# EAGLE design isa (EAGLE 9.4.0)
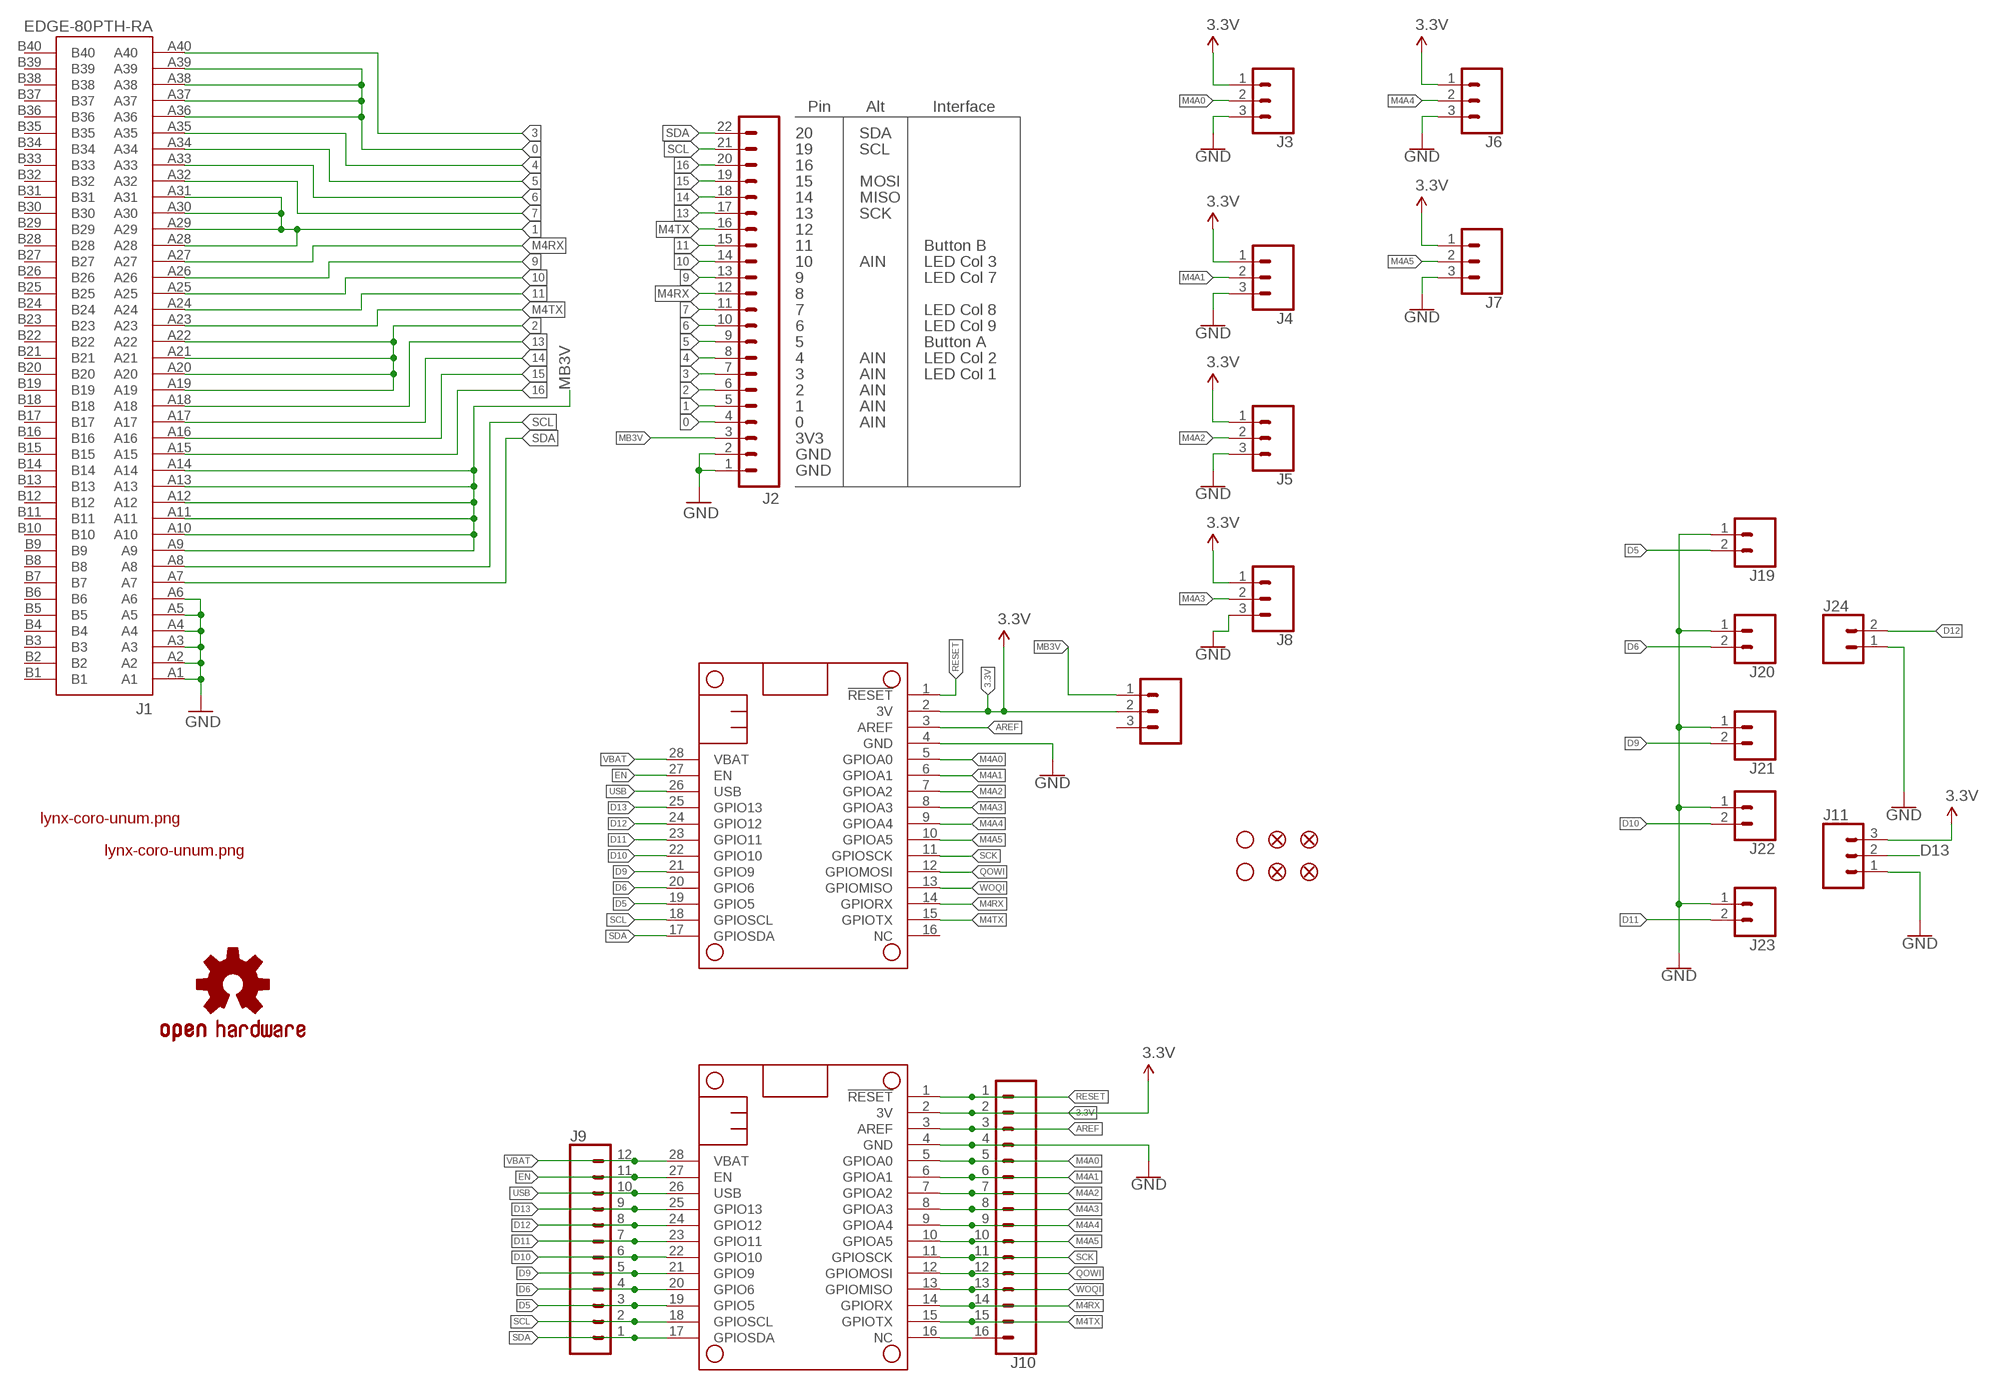
[diagram p0: schematic, sheet 1]

## Parts
FD1  FIDUCIAL1X2  [FIDUCIAL-1X2]
FD2  FIDUCIAL1X2  [FIDUCIAL-1X2]
FD3  FIDUCIAL1X2  [FIDUCIAL-1X2]
FD4  FIDUCIAL1X2  [FIDUCIAL-1X2]
H1  STAND-OFF  [STAND-OFF]
H2  STAND-OFF  [STAND-OFF]
J1  EDGE-80PTH-RA  [VEC-127-080-R]
J2  M22PTH  [1X22]
J3  CONN_03SCREW  [SCREWTERMINAL-3.5MM-3]
J4  CONN_03SCREW  [SCREWTERMINAL-3.5MM-3]
J5  CONN_03SCREW  [SCREWTERMINAL-3.5MM-3]
J6  CONN_03SCREW  [SCREWTERMINAL-3.5MM-3]
J7  CONN_03SCREW  [SCREWTERMINAL-3.5MM-3]
J8  CONN_03SCREW  [SCREWTERMINAL-3.5MM-3]
J9  CONN_12LOCK  [1X12_LOCK]
J10  CONN_16LOCK  [1X16_LOCK]
J11  CONN_03SCREW  [SCREWTERMINAL-3.5MM-3]
J12  CONN_03  [1X03]
J19  CONN_023.5MM  [SCREWTERMINAL-3.5MM-2]
J20  CONN_023.5MM  [SCREWTERMINAL-3.5MM-2]
J21  CONN_023.5MM  [SCREWTERMINAL-3.5MM-2]
J22  CONN_023.5MM  [SCREWTERMINAL-3.5MM-2]
J23  CONN_023.5MM  [SCREWTERMINAL-3.5MM-2]
J24  CONN_023.5MM  [SCREWTERMINAL-3.5MM-2]
LOGO3  OSHW-LOGOS  [OSHW-LOGO-S]
MS1  FEATHERWING_NODIM  [FEATHERWING_DIM]
MS2  FEATHERWING_NODIM  [FEATHERWING_DIM]
U$3  LYNX#CORO#UNUM#PNG  [LYNX#CORO#UNUM#PNG]
U$4  LYNX#CORO#UNUM#PNG  [LYNX#CORO#UNUM#PNG]

## Nets
0: J1.A36 J1.A37 J1.A38 J1.A39 J2.4
1: J1.A28 J1.A29 J1.A30 J1.A31 J2.5
2: J1.A19 J1.A20 J1.A21 J1.A22 J2.6
3: J1.A40 J2.7
3.3V: J3.1 J4.1 J5.1 J6.1 J7.1 J8.1 J10.2 J11.3 J12.2 MS1.2(3V) MS2.2(3V)
4: J1.A35 J2.8
5: J1.A34 J2.9
6: J1.A33 J2.10
7: J1.A32 J2.11
9: J1.A26 J2.13
10: J1.A25 J2.14
11: J1.A24 J2.15
13: J1.A18 J2.17
14: J1.A17 J2.18
15: J1.A16 J2.19
16: J1.A15 J2.20
AREF: J10.3 MS1.3(AREF) MS2.3(AREF)
D5: J9.3 J19.2 MS1.19(GPIO5) MS2.19(GPIO5)
D6: J9.4 J20.2 MS1.20(GPIO6) MS2.20(GPIO6)
D9: J9.5 J21.2 MS1.21(GPIO9) MS2.21(GPIO9)
D10: J9.6 J22.2 MS1.22(GPIO10) MS2.22(GPIO10)
D11: J9.7 J23.2 MS1.23(GPIO11) MS2.23(GPIO11)
D12: J9.8 J24.2 MS1.24(GPIO12) MS2.24(GPIO12)
D13: J9.9 J11.2 MS1.25(GPIO13) MS2.25(GPIO13)
EN: J9.11 MS1.27(EN) MS2.27(EN)
GND: J1.A1 J1.A2 J1.A3 J1.A4 J1.A5 J1.A6 J2.1 J2.2 J3.3 J4.3 J5.3 J6.3 J7.3 J8.3 J10.4 J11.1 J19.1 J20.1 J21.1 J22.1 J23.1 J24.1 MS1.4(GND) MS2.4(GND)
M4A0: J3.2 J10.5 MS1.5(GPIOA0) MS2.5(GPIOA0)
M4A1: J4.2 J10.6 MS1.6(GPIOA1) MS2.6(GPIOA1)
M4A2: J5.2 J10.7 MS1.7(GPIOA2) MS2.7(GPIOA2)
M4A3: J8.2 J10.8 MS1.8(GPIOA3) MS2.8(GPIOA3)
M4A4: J6.2 J10.9 MS1.9(GPIOA4) MS2.9(GPIOA4)
M4A5: J7.2 J10.10 MS1.10(GPIOA5) MS2.10(GPIOA5)
M4RX: J1.A27 J2.12 J10.14 MS1.14(GPIORX) MS2.14(GPIORX)
M4TX: J1.A23 J2.16 J10.15 MS1.15(GPIOTX) MS2.15(GPIOTX)
MB3V: J1.A9 J1.A10 J1.A11 J1.A12 J1.A13 J1.A14 J2.3 J12.1
N$15: J10.16 MS2.16(NC)
QOWI: J10.12 MS1.12(GPIOMOSI) MS2.12(GPIOMOSI)
RESET: J10.1 MS1.1(!RESET) MS2.1(!RESET)
SCK: J10.11 MS1.11(GPIOSCK) MS2.11(GPIOSCK)
SCL: J1.A8 J2.21 J9.2 MS1.18(GPIOSCL) MS2.18(GPIOSCL)
SDA: J1.A7 J2.22 J9.1 MS1.17(GPIOSDA) MS2.17(GPIOSDA)
USB: J9.10 MS1.26(USB) MS2.26(USB)
VBAT: J9.12 MS1.28(VBAT) MS2.28(VBAT)
WOQI: J10.13 MS1.13(GPIOMISO) MS2.13(GPIOMISO)
Unconnected: J1.B1 J1.B2 J1.B3 J1.B4 J1.B5 J1.B6 J1.B7 J1.B8 J1.B9 J1.B10 J1.B11 J1.B12 J1.B13 J1.B14 J1.B15 J1.B16 J1.B17 J1.B18 J1.B19 J1.B20 J1.B21 J1.B22 J1.B23 J1.B24 J1.B25 J1.B26 J1.B27 J1.B28 J1.B29 J1.B30 J1.B31 J1.B32 J1.B33 J1.B34 J1.B35 J1.B36 J1.B37 J1.B38 J1.B39 J1.B40 J12.3 MS1.16(NC)

## Notes on the sheet
- Pin | Alt | Interface
- 20 | SDA
- 19 | SCL
- 16
- 15 | MOSI
- 14 | MISO
- 13 | SCK
- 12
- 11 | Button B
- 10 | AIN | LED Col 3
- 9 | LED Col 7
- 8
- 7 | LED Col 8
- 6 | LED Col 9
- 5 | Button A
- 4 | AIN | LED Col 2
- 3 | AIN | LED Col 1
- 2 | AIN
- 1 | AIN
- 0 | AIN
- 3V3
- GND
- GND

## Library data of the parts
FD1-FD4 = SparkFun-Aesthetics:FIDUCIAL: Fiducial Alignment Points Various fiducial points for machine vision alignment.
H1 H2 = SparkFun-Electromechanical:STAND-OFF: #4 Stand Off This is the mechanical footprint for a #4 phillips button head screw. Use the keepout ring to avoid running the screw head into surrounding components. SKU : PRT-00447
J1 = local_lib:EDGE-80: Card edge connector (80 pin) for accepting a PCB with finger edge pins. This connector will accept the BBC micro:bit board.; PROD_ID: CONN-13452
J2 = local_lib:M22: Standard 22-pin 0.1" header; PROD_ID: CONN-13453
J3-J8 J11 = SparkFun-Connectors:CONN_03: Multi connection point. Often used as Generic Header-pin footprint for 0.1 inch spaced/style header connections On any of the 0.1 inch spaced packages, you can populate with these: Break Away Headers - Straight <https://www.sparkfun.com/products/116> (PRT-00116) Break Away Male Headers - Right Angle <https://www.sparkfun.com/products/553> (PRT-00553) Female Headers <https://www.sparkfun.com/products/115> (PRT-00115) Break Away Headers - Machine Pin <https://www.sparkfun.com/products/117> (PRT-00117) Break Away Female Headers - Swiss Machine Pin <https://www.sparkfun.com/products/743> (PRT-00743) Stackable Header - 3 Pin (Female, 0.1") <https://www.sparkfun.com/products/13875> (PRT-13875) For SCREWTERMINALS and SPRING TERMINALS visit here: Screw Terimnals on SparkFun.com <https://www.sparkfun.com/search/results?term=Screw+Terminals> (5mm/3.5mm/2.54mm spacing) This device is also useful as a general connection point to wire up your design to another part of your project. Our various solder wires solder well into these plated through hole pads. Hook-Up Wire - Assortment (Stranded, 22 AWG) <https://www.sparkfun.com/products/11375> (PRT-11375) Hook-Up Wire - Assortment (Solid Core, 22 AWG) <https://www.sparkfun.com/products/11367> (PRT-11367) View the entire wire category on our website here <https://www.sparkfun.com/categories/141> Special notes: Molex polarized connector foot print use with SKU : PRT-08232 with associated crimp pins and housings.; PROD_ID: CONN-08288; SF_ID: PRT-08235
J9 = SparkFun-Connectors:CONN_12: Multi connection point. Often used as Generic Header-pin footprint for 0.1 inch spaced/style header connections On any of the 0.1 inch spaced packages, you can populate with these: Break Away Headers - Straight <https://www.sparkfun.com/products/116> (PRT-00116) Break Away Male Headers - Right Angle <https://www.sparkfun.com/products/553> (PRT-00553) Female Headers <https://www.sparkfun.com/products/115> (PRT-00115) Break Away Headers - Machine Pin <https://www.sparkfun.com/products/117> (PRT-00117) Break Away Female Headers - Swiss Machine Pin <https://www.sparkfun.com/products/743> (PRT-00743) For SCREWTERMINALS and SPRING TERMINALS visit here: Screw Terimnals on SparkFun.com <https://www.sparkfun.com/search/results?term=Screw+Terminals> (5mm/3.5mm/2.54mm spacing) This device is also useful as a general connection point to wire up your design to another part of your project. Our various solder wires solder well into these plated through hole pads. Hook-Up Wire - Assortment (Stranded, 22 AWG) <https://www.sparkfun.com/products/11375> (PRT-11375) Hook-Up Wire - Assortment (Solid Core, 22 AWG) <https://www.sparkfun.com/products/11367> (PRT-11367) View the entire wire category on our website here <https://www.sparkfun.com/categories/141> Special notes: Molex polarized connector foot print use with SKU : PRT-08231 with associated crimp pins and housings. 1MM SMD Version SKU: PRT-10208 NOTES ON THE VARIANTS LOCK and LOCK_LONGPADS... This footprint was designed to help hold the alignment of a through-hole component (i.e. 6-pin header) while soldering it into place. You may notice that each hole has been shifted either up or down by 0.005 of an inch from it's more standard position (which is a perfectly straight line). This slight alteration caused the pins (the squares in the middle) to touch the edges of the holes. Because they are alternating, it causes a "brace" to hold the component in place. 0.005 has proven to be the perfect amount of "off-center" position when using our standard breakaway headers. Although looks a little odd when you look at the bare footprint, once you have a header in there, the alteration is very hard to notice. Also,if you push a header all the way into place, it is covered up entirely on the bottom side.
J10 = SparkFun-Connectors:CONN_16: Multi connection point. Often used as Generic Header-pin footprint for 0.1 inch spaced/style header connections On any of the 0.1 inch spaced packages, you can populate with these: Break Away Headers - Straight <https://www.sparkfun.com/products/116> (PRT-00116) Break Away Male Headers - Right Angle <https://www.sparkfun.com/products/553> (PRT-00553) Female Headers <https://www.sparkfun.com/products/115> (PRT-00115) Break Away Headers - Machine Pin <https://www.sparkfun.com/products/117> (PRT-00117) Break Away Female Headers - Swiss Machine Pin <https://www.sparkfun.com/products/743> (PRT-00743) For SCREWTERMINALS and SPRING TERMINALS visit here: Screw Terimnals on SparkFun.com <https://www.sparkfun.com/search/results?term=Screw+Terminals> (5mm/3.5mm/2.54mm spacing) This device is also useful as a general connection point to wire up your design to another part of your project. Our various solder wires solder well into these plated through hole pads. Hook-Up Wire - Assortment (Stranded, 22 AWG) <https://www.sparkfun.com/products/11375> (PRT-11375) Hook-Up Wire - Assortment (Solid Core, 22 AWG) <https://www.sparkfun.com/products/11367> (PRT-11367) View the entire wire category on our website here <https://www.sparkfun.com/categories/141> Special notes: Molex polarized connector foot print use with SKU : PRT-08231 with associated crimp pins and housings. 1MM SMD Version SKU: PRT-10208 NOTES ON THE VARIANTS LOCK and LOCK_LONGPADS... This footprint was designed to help hold the alignment of a through-hole component (i.e. 6-pin header) while soldering it into place. You may notice that each hole has been shifted either up or down by 0.005 of an inch from it's more standard position (which is a perfectly straight line). This slight alteration caused the pins (the squares in the middle) to touch the edges of the holes. Because they are alternating, it causes a "brace" to hold the component in place. 0.005 has proven to be the perfect amount of "off-center" position when using our standard breakaway headers. Although looks a little odd when you look at the bare footprint, once you have a header in there, the alteration is very hard to notice. Also,if you push a header all the way into place, it is covered up entirely on the bottom side.
J12 = SparkFun-Connectors:CONN_03: Multi connection point. Often used as Generic Header-pin footprint for 0.1 inch spaced/style header connections On any of the 0.1 inch spaced packages, you can populate with these: Break Away Headers - Straight <https://www.sparkfun.com/products/116> (PRT-00116) Break Away Male Headers - Right Angle <https://www.sparkfun.com/products/553> (PRT-00553) Female Headers <https://www.sparkfun.com/products/115> (PRT-00115) Break Away Headers - Machine Pin <https://www.sparkfun.com/products/117> (PRT-00117) Break Away Female Headers - Swiss Machine Pin <https://www.sparkfun.com/products/743> (PRT-00743) Stackable Header - 3 Pin (Female, 0.1") <https://www.sparkfun.com/products/13875> (PRT-13875) For SCREWTERMINALS and SPRING TERMINALS visit here: Screw Terimnals on SparkFun.com <https://www.sparkfun.com/search/results?term=Screw+Terminals> (5mm/3.5mm/2.54mm spacing) This device is also useful as a general connection point to wire up your design to another part of your project. Our various solder wires solder well into these plated through hole pads. Hook-Up Wire - Assortment (Stranded, 22 AWG) <https://www.sparkfun.com/products/11375> (PRT-11375) Hook-Up Wire - Assortment (Solid Core, 22 AWG) <https://www.sparkfun.com/products/11367> (PRT-11367) View the entire wire category on our website here <https://www.sparkfun.com/categories/141> Special notes: Molex polarized connector foot print use with SKU : PRT-08232 with associated crimp pins and housings.
J19-J24 = SparkFun-Connectors:CONN_02: Multi connection point. Often used as Generic Header-pin footprint for 0.1 inch spaced/style header connections On any of the 0.1 inch spaced packages, you can populate with these: Break Away Headers - Straight <https://www.sparkfun.com/products/116> (PRT-00116) Break Away Male Headers - Right Angle <https://www.sparkfun.com/products/553> (PRT-00553) Female Headers <https://www.sparkfun.com/products/115> (PRT-00115) Break Away Headers - Machine Pin <https://www.sparkfun.com/products/117> (PRT-00117) Break Away Female Headers - Swiss Machine Pin <https://www.sparkfun.com/products/743> (PRT-00743) For SCREWTERMINALS and SPRING TERMINALS visit here: Screw Terimnals on SparkFun.com <https://www.sparkfun.com/search/results?term=Screw+Terminals> (5mm/3.5mm/2.54mm spacing) This device is also useful as a general connection point to wire up your design to another part of your project. Our various solder wires solder well into these plated through hole pads. Hook-Up Wire - Assortment (Stranded, 22 AWG) <https://www.sparkfun.com/products/11375> (PRT-11375) Hook-Up Wire - Assortment (Solid Core, 22 AWG) <https://www.sparkfun.com/products/11367> (PRT-11367) View the entire wire category on our website here <https://www.sparkfun.com/categories/141> Special notes: Molex polarized connector foot print use with: PRT-08233 with associated crimp pins and housings. 2.54_SCREWTERM for use with PRT-10571. 3.5mm Screw Terminal footprints for PRT-08084 5mm Screw Terminal footprints for use with PRT-08432; PROD_ID: CONN-08399
LOGO3 = SparkFun-Aesthetics:OSHW-LOGO: Open Source Hardware Logo This logo indicates the piece of hardware it is found on incorporates a OSHW license and/or adheres to the definition of open source hardware found here: http://freedomdefined.org/OSHW
MS1 MS2 = adafruit:FEATHERWING
U$3 = lynx#coro#unum#png:LYNX#CORO#UNUM#PNG
U$4 = big-lynx:LYNX#CORO#UNUM#PNG

## Board
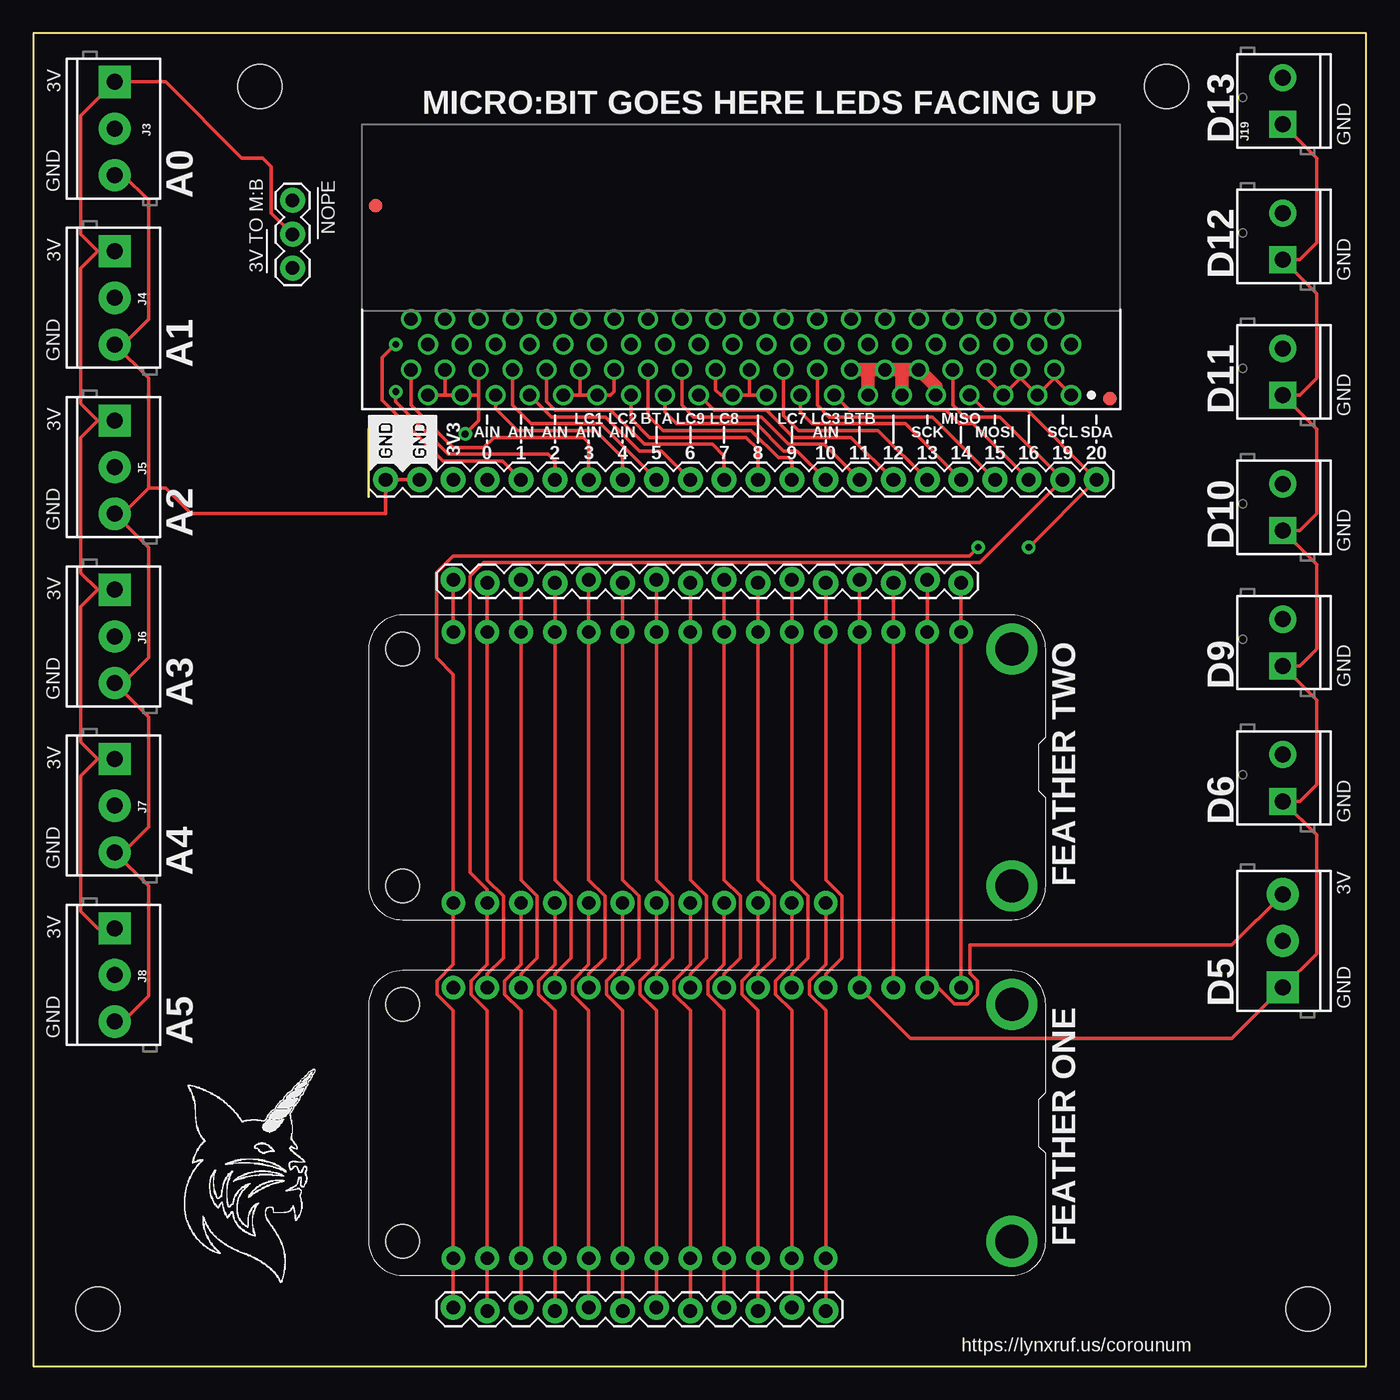
[diagram p1: board, top side]
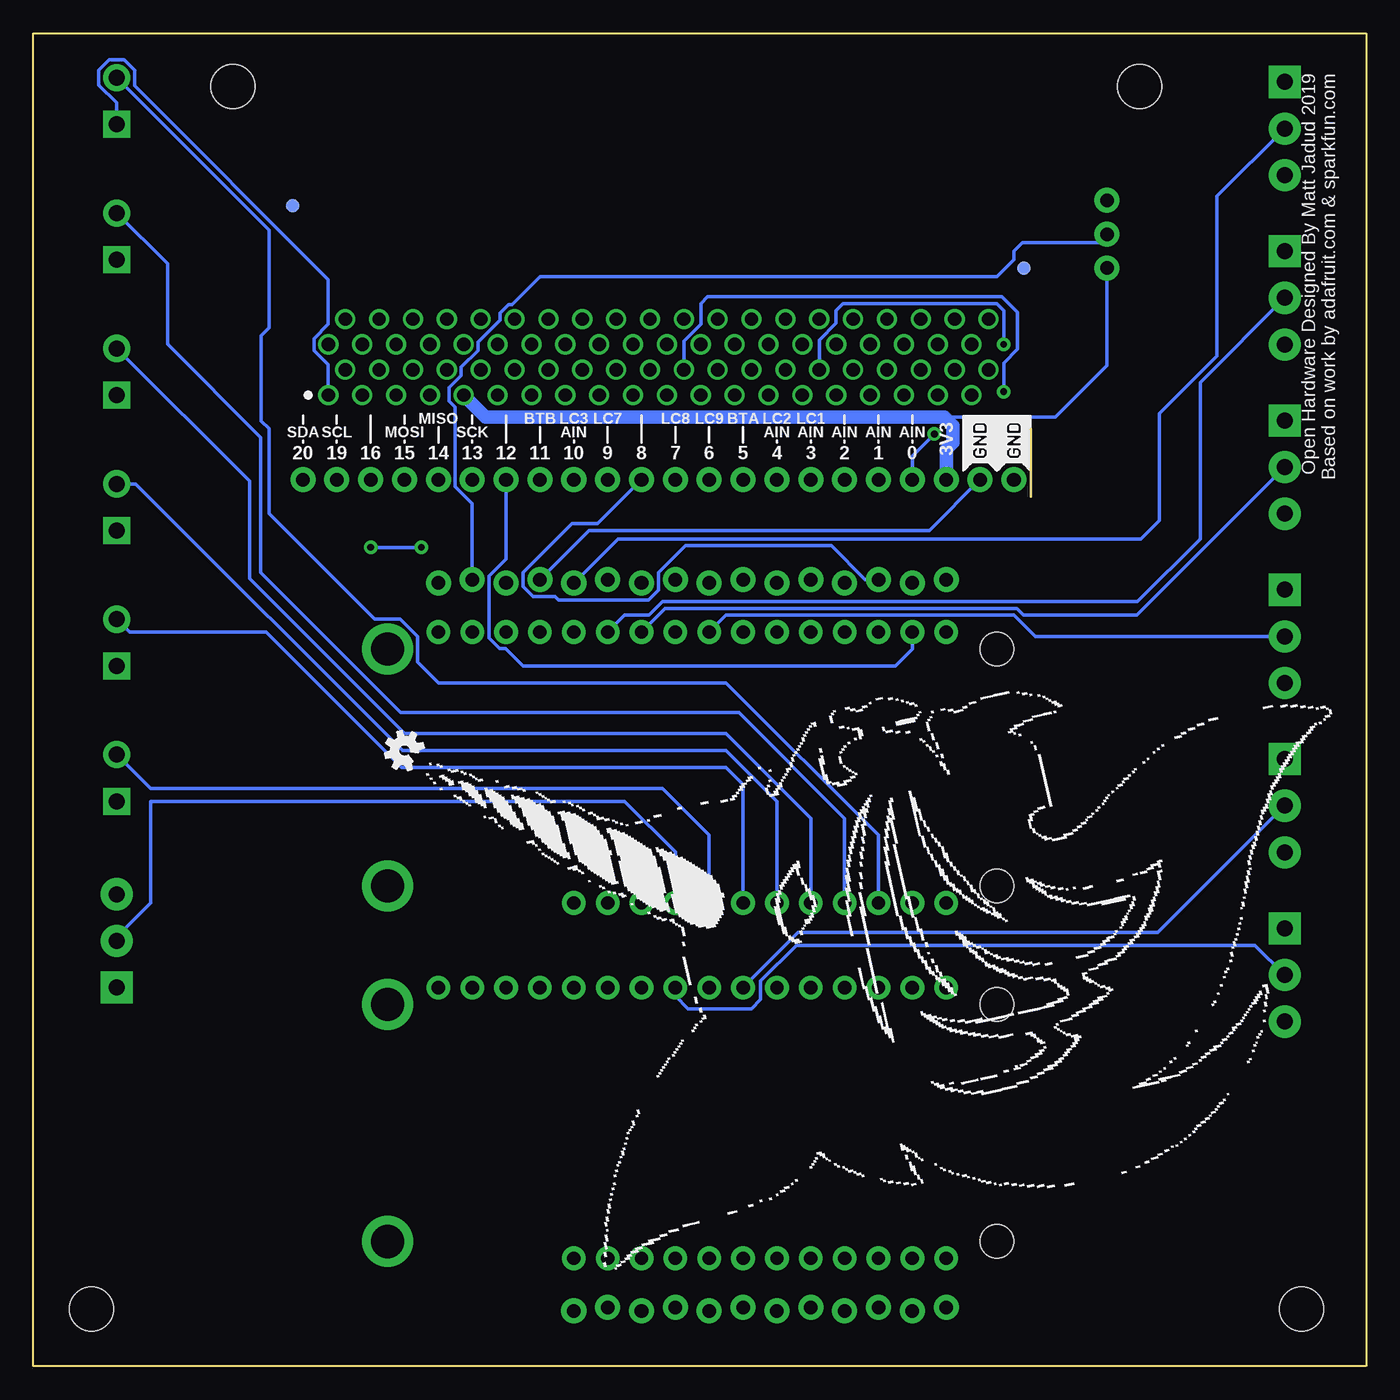
[diagram p2: board, bottom side, seen from below]

Size 100 x 100 mm. Coordinates in mm from the lower left corner, seen from the top.
Outline: 25.16,70.32 25.16,65.24
Outline: 0,100 0,0 100,0 100,100 0,100
Copper layers (1*16): Top 0.035mm / dielectric 1.5mm / Bottom 0.035mm
Design rules "SparkFun-2-layer-STANDARD": minimum track width 10mil, minimum drill 20mil, track to track 10mil, track to pad 8mil, pad to pad 8mil, via to via 10mil, smd to smd 8mil, copper to edge 8mil, drill to drill 8mil, minimum pad ring 10mil, minimum via ring 10mil, stop-mask expansion 4mil, vias tented up to drill 25mil, thermal gap 10mil

### Footprints (pad centres in the part's own frame; a part is rotated, then mirrored left to right if it is on the bottom)
FIDUCIAL-1X2 = smd 1 x 1: 1 0,0
STAND-OFF = hole 3.302: 0,0
VEC-127-080-R = drill 1: A1 -24.765,0; A2 -23.495,-1.9; A3 -22.225,0; A4 -20.955,-1.9; A5 -19.685,0; A6 -18.415,-1.9; A7 -17.145,0; A8 -15.875,-1.9; A9 -14.605,0; A10 -13.335,-1.9; A11 -12.065,0; A12 -10.795,-1.9; A13 -9.525,0; A14 -8.255,-1.9; A15 -6.985,0; A16 -5.715,-1.9; A17 -4.445,0; A18 -3.175,-1.9; A19 -1.905,0; A20 -0.635,-1.9; A21 0.635,0; A22 1.905,-1.9; A23 3.175,0; A24 4.445,-1.9; A25 5.715,0; A26 6.985,-1.9; A27 8.255,0; A28 9.525,-1.9; A29 10.795,0; A30 12.065,-1.9; A31 13.335,0; A32 14.605,-1.9; A33 15.875,0; A34 17.145,-1.9; A35 18.415,0; A36 19.685,-1.9; A37 20.955,0; A38 22.225,-1.9; A39 23.495,0; A40 24.765,-1.9; B1 -24.765,-3.8; B2 -23.495,-5.7; B3 -22.225,-3.8; B4 -20.955,-5.7; B5 -19.685,-3.8; B6 -18.415,-5.7; B7 -17.145,-3.8; B8 -15.875,-5.7; B9 -14.605,-3.8; B10 -13.335,-5.7; B11 -12.065,-3.8; B12 -10.795,-5.7; B13 -9.525,-3.8; B14 -8.255,-5.7; B15 -6.985,-3.8; B16 -5.715,-5.7; B17 -4.445,-3.8; B18 -3.175,-5.7; B19 -1.905,-3.8; B20 -0.635,-5.7; B21 0.635,-3.8; B22 1.905,-5.7; B23 3.175,-3.8; B24 4.445,-5.7; B25 5.715,-3.8; B26 6.985,-5.7; B27 8.255,-3.8; B28 9.525,-5.7; B29 10.795,-3.8; B30 12.065,-5.7; B31 13.335,-3.8; B32 14.605,-5.7; B33 15.875,-3.8; B34 17.145,-5.7; B35 18.415,-3.8; B36 19.685,-5.7; B37 20.955,-3.8; B38 22.225,-5.7; B39 23.495,-3.8; B40 24.765,-5.7
1X22 = drill 1.016 pad 1.88: 1 0,0; 2 2.54,0; 3 5.08,0; 4 7.62,0; 5 10.16,0; 6 12.7,0; 7 15.24,0; 8 17.78,0; 9 20.32,0; 10 22.86,0; 11 25.4,0; 12 27.94,0; 13 30.48,0; 14 33.02,0; 15 35.56,0; 16 38.1,0; 17 40.64,0; 18 43.18,0; 19 45.72,0; 20 48.26,0; 21 50.8,0; 22 53.34,0
SCREWTERMINAL-3.5MM-3 = drill 1.2 pad 2.413 square: 1 0,0 | drill 1.2 pad 2.413: 2 3.5,0; 3 7,0
1X12_LOCK = drill 1.016 pad 1.88: 1 0,0.127; 2 2.54,-0.127; 3 5.08,0.127; 4 7.62,-0.127; 5 10.16,0.127; 6 12.7,-0.127; 7 15.24,0.127; 8 17.78,-0.127; 9 20.32,0.127; 10 22.86,-0.127; 11 25.4,0.127; 12 27.94,-0.127
1X16_LOCK = drill 1.016 pad 1.88: 1 0,0.127; 2 2.54,-0.127; 3 5.08,0.127; 4 7.62,-0.127; 5 10.16,0.127; 6 12.7,-0.127; 7 15.24,0.127; 8 17.78,-0.127; 9 20.32,0.127; 10 22.86,-0.127; 11 25.4,0.127; 12 27.94,-0.127; 13 30.48,0.127; 14 33.02,-0.127; 15 35.56,0.127; 16 38.1,-0.127
1X03 = drill 1.016 pad 1.88: 1 0,0; 2 2.54,0; 3 5.08,0
SCREWTERMINAL-3.5MM-2 = drill 1.2 pad 2.032 square: 1 0,0 | drill 1.2 pad 2.032: 2 3.5,0
FEATHERWING_DIM = drill 1 pad 1.778: 1 6.35,1.27; 2 8.89,1.27; 3 11.43,1.27; 4 13.97,1.27; 5 16.51,1.27; 6 19.05,1.27; 7 21.59,1.27; 8 24.13,1.27; 9 26.67,1.27; 10 29.21,1.27; 11 31.75,1.27; 12 34.29,1.27; 13 36.83,1.27; 14 39.37,1.27; 15 41.91,1.27; 16 44.45,1.27; 17 44.45,21.59; 18 41.91,21.59; 19 39.37,21.59; 20 36.83,21.59; 21 34.29,21.59; 22 31.75,21.59; 23 29.21,21.59; 24 26.67,21.59; 25 24.13,21.59; 26 21.59,21.59; 27 19.05,21.59; 28 16.51,21.59 | drill 2.5 pad 3.81: P$1 2.54,20.32; P$2 2.54,2.54 | hole 2.54: 48.26,20.32; 48.26,2.54

### Placement (x,y rotation side)
FD1  25.67,87.08 0 top
FD2  80.79,72.61 0 top
FD3  80.53,87.08 0 bottom
FD4  25.67,82.38 0 bottom
H1  17.01,96.02 0 top
H2  85.02,96.02 0 top
H3  STAND-OFF  [STAND-OFF]  95.64,4.28 0 top
H4  STAND-OFF  [STAND-OFF]  4.84,4.28 0 top
J1  53.1,72.86 180 top
J2  26.43,66.51 0 top
J3  6.11,96.35 270 top
J4  6.11,83.66 270 top
J5  6.11,70.95 270 top
J6  6.11,58.26 270 top
J7  6.11,45.55 270 top
J8  6.11,32.86 270 top
J9  31.51,4.28 0 top
J10  69.61,58.89 180 top
J11  93.74,28.41 90 top
J12  19.45,82.38 90 top
J19  93.74,93.18 90 top
J20  93.74,83.02 90 top
J21  93.74,72.86 90 top
J22  93.74,62.7 90 top
J23  93.74,52.54 90 top
J24  93.74,42.38 90 top
LOGO3  72.15,46.19 60.2 bottom
MS1  75.96,29.68 180 top
MS2  75.96,56.35 180 top
U$1  [NEGASILK_MICRO_BIT_BREAKOUT]  25.16,67.14 0 top
U$2  [NEGASILK_MICRO_BIT_BREAKOUT]  30.24,67.14 0 bottom
U$3  16.27,14.44 0 top
U$4  34.05,32.22 102.6 bottom

### Tracks (layer width: path | path; a pad name or v marks a point on that pad's centre or on a via)
0  (via drill 0.51)
  Top 0.254: J1.A39 30.88,72.86 | 30.88,72.86 J1.A37 33.41,72.86 | J1.A38 30.88,72.86 | J1.A36 33.41,72.86 | v32.4,69.94 33.41,70.95 33.41,72.86
  Bottom 0.254: J2.4 34.05,68.29 v32.4,69.94
1  (via drill 0.51)
  Top 0.254: J1.A31 41.03,72.86 | 41.03,72.86 J1.A29 43.32,72.86 43.58,73.11 J1.A28 | J2.5 35.19,67.91 30.75,67.91 26.18,72.48 26.18,75.65 v27.19,76.67 | J1.A30 41.03,72.86
  Bottom 0.254: v27.19,76.67 27.19,79.21 27.7,79.72 39.26,79.72 39.77,79.21 39.77,78.25 41.03,76.97 J1.A30
2  (via drill 0.51)
  Top 0.254: J1.A19 53.73,72.86 | 53.73,72.86 J1.A21 51.58,72.86 51.2,73.24 J1.A22 | J1.A20 53.73,72.86 | J2.6 39.13,67.91 38.62,68.41 31.13,68.41 27.19,72.35 v27.19,73.11
  Bottom 0.254: J1.A22 51.2,76.92 49.92,78.19 49.92,79.72 49.42,80.23 27.32,80.23 26.18,79.08 26.18,76.29 27.19,75.27 v27.19,73.11
3
  Top 0.254: J2.7 41.67,69.3 41.29,69.69 34.56,69.69 33.8,68.92 31.51,68.92 28.34,72.1 J1.A40
3.3V
  Top 0.254: J10.2 MS2.2 MS1.2 67.89,28.41 69.1,27.19 70.12,27.19 70.83,27.91 70.83,28.91 70.26,29.48 70.26,31.6 89.93,31.6 J11.3 | 4.84,83.66 3.57,84.92 3.57,93.81 J3.1 9.92,96.35 15.63,90.64 17.22,90.64 17.86,90 17.86,86.51 J12.2 | J4.1 4.84,83.66 | 4.84,83.66 3.57,82.38 3.57,72.22 4.84,70.95 | J5.1 4.84,70.95 | 4.84,70.95 3.57,69.69 3.57,59.52 4.84,58.26 | J6.1 4.84,58.26 | 4.84,58.26 3.57,56.98 3.57,46.83 4.84,45.55 | J7.1 4.84,45.55 | 4.84,45.55 3.57,44.28 3.57,34.12 4.84,32.86 J8.1
  Bottom 0.254: J10.2 67.07,64.71 68.34,65.98 68.34,71.96 68.79,72.41 68.79,73.41 67.89,74.31 67.89,74.94 66.62,76.21 66.62,76.84 64.98,78.48 64.98,79.01 64.34,79.64 64.1,79.64 61.99,81.75 27.7,81.75 26.43,83.02 26.43,83.66 25.8,84.29 20.08,84.29 J12.2
4
  Top 0.254: J1.A35 34.69,71.84 36.34,70.19 42.18,70.19 44.21,68.16 J2.8
5
  Top 0.254: J1.A34 35.95,72.1 37.35,70.7 42.56,70.7 J2.9
6
  Top 0.254: J2.10 47.13,68.67 45.48,68.67 42.94,71.21 38.88,71.21 J1.A33
7
  Top 0.254: J2.11 51.83,68.29 50.94,69.18 45.86,69.18 43.32,71.72 39.13,71.72 38.5,72.35 J1.A32
9
  Top 0.254: J1.A26 46.11,71.34 47.26,70.19 53.86,70.19 55.89,68.16 56.66,68.16 56.91,67.91 J2.13
10
  Top 0.254: J2.14 57.29,68.67 56.27,68.67 54.24,70.7 48.27,70.7 47.38,71.59 J1.A25
11
  Top 0.254: J2.15 59.32,69.18 56.66,69.18 54.62,71.21 49.54,71.21 48.66,72.1 J1.A24
13
  Top 0.254: J1.A18 56.27,71.34 57.42,70.19 63.39,70.19 J2.17
14
  Top 0.254: J1.A17 57.55,71.59 58.43,70.7 65.42,70.7 J2.18
15
  Top 0.254: J1.A16 58.81,72.1 59.7,71.21 67.45,71.21 J2.19
16
  Top 0.254: J1.A15 61.23,71.72 68.47,71.72 69.48,70.7 70.5,70.7 J2.20
AREF
  Top 0.254: J10.3 MS2.3 MS1.3
D5
  Top 0.254: J9.3 MS1.19 36.59,26.69 35.37,27.91 35.37,28.91 36.59,30.13 MS2.19
  Bottom 0.254: J19.2 82.31,85.25 82.31,77.93 82.9,77.34 82.9,70.92 82.31,70.33 82.31,63.97 74.38,56.05 72.49,56.05 71.19,54.74 71.19,52.84 69.61,51.27 48.02,51.27 36.59,39.84 MS2.19
D6
  Top 0.254: J9.4 MS1.20 39.13,26.69 37.91,27.91 37.91,28.91 39.13,30.13 MS2.20
  Bottom 0.254: J20.2 89.93,82.71 89.93,76.67 82.94,69.69 82.94,59.54 72.45,49.05 47.07,49.05 39.13,41.11 MS2.20
D9
  Top 0.254: J9.5 MS1.21 41.67,26.69 40.45,27.91 40.45,28.91 41.67,30.13 MS2.21
  Bottom 0.254: J21.2 83.77,66.39 83.77,59.08 72.15,47.46 48.02,47.46 41.67,41.11 MS2.21
D10
  Top 0.254: J9.6 MS1.22 44.21,26.69 42.99,27.91 42.99,28.91 44.21,30.13 MS2.22
  Bottom 0.254: J22.2 92.31,66.2 72.3,46.19 48.02,46.19 44.21,42.38 MS2.22
D11
  Top 0.254: J9.7 MS1.23 46.75,26.69 45.53,27.91 45.53,28.91 46.75,30.13 MS2.23
  Bottom 0.254: J23.2 92.78,55.08 82.55,55.08 72.39,44.92 48.02,44.92 46.75,43.65 MS2.23
D12
  Top 0.254: J9.8 MS1.24 49.29,26.69 48.07,27.91 48.07,28.91 49.29,30.13 MS2.24
  Bottom 0.254: J24.2 91.2,43.34 52.79,43.34 49.29,39.84 MS2.24
D13
  Top 0.254: J9.9 MS1.25 51.83,26.69 50.61,27.91 50.61,28.91 51.83,30.13 MS2.25
  Bottom 0.254: MS2.25 51.83,38.57 55.64,42.38 91.2,42.38 91.2,34.76 93.74,32.22 J11.2
EN
  Top 0.254: J9.11 MS1.27 56.91,26.69 55.69,27.91 55.69,28.91 56.91,30.13 MS2.27
GND
  Top 0.254: J10.4 MS2.4 MS1.4 65.8,24.6 89.93,24.6 J11.1 96.28,30.95 96.28,39.84 J24.1 95.01,42.38 96.28,43.65 96.28,50 J23.1 95.01,52.54 96.28,53.81 96.28,60.16 J22.1 95.01,62.7 96.28,63.97 96.28,70.32 J21.1 95.01,72.86 96.28,74.13 96.28,80.48 J20.1 95.01,83.02 96.28,84.29 96.28,90.64 J19.1 | J1.A1 76.59,74.13 | J1.A2 76.59,74.13 | 76.59,74.13 J1.A3 74.06,74.13 | J1.A4 74.06,74.13 | 74.06,74.13 J1.A5 71.52,74.13 J1.A6 | J2.2 J2.1 26.43,63.97 11.82,63.97 9.92,65.88 8.65,65.88 | J3.3 6.76,89.35 8.65,87.47 8.65,78.58 6.73,76.66 J4.3 8.65,74.11 8.65,65.88 | 8.65,65.88 6.73,63.95 J5.3 8.65,61.41 8.65,53.17 6.73,51.26 J6.3 8.65,48.72 8.65,40.48 6.73,38.55 J7.3 8.65,36.02 8.65,27.77 6.73,25.86 J8.3
  Bottom 0.254: J2.2 32.78,62.7 58.31,62.7 J10.4 | J19.1 93.74,94.78 95.09,96.12 95.09,97.24 94.3,98.03 93.18,98.03 92.39,97.24 92.39,96.05 77.87,81.52 77.87,78.19 78.95,77.11 78.95,76.21 77.87,75.13 J1.A1
M4A0
  Top 0.254: J10.5 MS2.5 59.45,36.48 60.67,35.27 60.67,30.64 59.45,29.42 MS1.5
  Bottom 0.254: J3.2 11.19,87.78 11.19,75.79 15.51,71.47 15.51,63.46 16.91,62.06 56.15,62.06 J10.5
M4A1
  Top 0.254: J10.6 MS2.6 56.91,36.48 58.13,35.27 58.13,30.64 56.91,29.42 MS1.6
  Bottom 0.254: J4.2 12.46,73.81 12.46,62.06 17.16,57.37 52.8,57.37 53.82,56.35 55.64,56.35 MS2.6
M4A2
  Top 0.254: J10.7 MS2.7 54.37,36.48 55.59,35.27 55.59,30.64 54.37,29.42 MS1.7
  Bottom 0.254: J5.2 17.21,56.35 25.71,56.35 26.22,56.86 52.59,56.86 MS2.7
M4A3
  Top 0.254: J10.8 MS2.8 51.83,36.48 53.05,35.27 53.05,30.64 51.83,29.42 MS1.8
  Bottom 0.254: J8.2 8.34,31.59 42.76,31.59 45.43,28.91 45.43,27.51 46.11,26.82 50.88,26.82 51.83,27.77 MS1.8
M4A4
  Top 0.254: J10.9 MS2.9 49.29,36.48 50.51,35.27 50.51,30.64 49.29,29.42 MS1.9
  Bottom 0.254: J6.2 24.84,54.76 26.43,56.35 48.02,56.35 MS2.9
M4A5
  Top 0.254: J10.10 MS2.10 46.75,36.48 47.97,35.27 47.97,30.64 46.75,29.42 MS1.10
  Bottom 0.254: J7.2 15.63,32.54 42.62,32.54 MS1.10
M4RX
  Top 0.254: J10.14 MS2.14 36.59,36.48 37.81,35.27 37.81,30.64 36.59,29.42 MS1.14 | J1.A27 44.84,71.08 46.24,69.69 53.48,69.69 54.37,68.8 J2.12
  Bottom 0.254: J2.12 57.67,63.21 59.59,63.21 63.26,59.54 63.26,58.49 62.52,57.75 60.85,57.75 60.59,57.49 53.84,57.49 53.1,58.24 53.1,59.54 51.09,61.56 40.13,61.56 37.59,59.02 J10.14
M4TX
  Top 0.254: J10.15 MS2.15 34.05,36.48 35.27,35.27 35.27,30.64 34.05,29.42 MS1.15 | J1.A23 51.07,71.72 55.01,71.72 57.04,69.69 61.35,69.69 J2.16
  Bottom 0.254: J2.16 64.53,60.56 65.8,59.29 65.8,54.63 65.03,53.86 64.58,53.86 63.26,52.54 35.32,52.54 34.05,53.81 MS2.15
MB3V
  Top 1.016: J1.A9 67.7,73.49 J1.A10 65.04,74.76 | 65.04,74.76 J1.A12 62.5,74.76 | 62.5,74.76 J1.A14 | J1.A13 62.62,74.63 62.5,74.76 | J1.A11 65.16,74.63 65.04,74.76
  Bottom 0.254: J12.1 19.45,75.06 23.3,71.21 31.64,71.21
  Bottom 1.016: J1.A9 66.05,71.21 31.64,71.21 31,70.57 31,69.3 31.51,68.8 J2.3
N$15
  Top 0.254: J10.16 MS2.16
QOWI
  Top 0.254: J10.12 MS2.12 41.67,36.48 42.89,35.27 42.89,30.64 41.67,29.42 MS1.12
RESET
  Top 0.254: J10.1 MS2.1 MS1.1
SCK
  Top 0.254: MS1.11 44.21,29.42 45.43,30.64 45.43,35.27 44.21,36.48 MS2.11 J10.11
SCL
  Top 0.254: J1.A8 68.97,72.1 69.86,71.21 72.53,71.21 J2.21 71.01,60.29 33.78,60.29 32.78,59.29 32.78,37.04 34.05,35.77 MS2.18 34.05,30.13 32.83,28.91 32.83,27.91 34.05,26.69 MS1.18 J9.2
SDA  (via drill 0.51)
  Top 0.254: J1.A7 71.39,71.72 74.56,71.72 J2.22 v74.69,61.43 | J9.1 MS1.17 31.51,26.69 30.29,27.91 30.29,28.91 31.51,30.13 MS2.17 31.51,51.91 30.24,53.17 30.24,59.54 31.49,60.8 70.25,60.8 v70.88,61.43
  Bottom 0.254: v74.69,61.43 v70.88,61.43
USB
  Top 0.254: J9.10 MS1.26 54.37,26.69 53.15,27.91 53.15,28.91 54.37,30.13 MS2.26
VBAT
  Top 0.254: J9.12 MS1.28 59.45,26.69 58.23,27.91 58.23,28.91 59.45,30.13 MS2.28
WOQI
  Top 0.254: J10.13 MS2.13 39.13,36.48 40.35,35.27 40.35,30.64 39.13,29.42 MS1.13

### Text on the board
tPlace: LC1 | LC2 | BTA | LC9 | LC8 | LC7 | LC3 | BTB | MISO | 3V3 | AIN | AIN | AIN | AIN | AIN | AIN | SCK | MOSI | SCL | SDA | 0 | 1 | 2 | 3 | 4 | 5 | 6 | 7 | 8 | 9 | 10 | 11 | 12 | 13 | 14 | 15 | 16 | 19 | 20
bPlace: Open Hardware Designed By Matt Jadud 2019 / Based on work by adafruit.com & sparkfun.com | LC1 | LC2 | BTA | LC9 | LC8 | LC7 | LC3 | BTB | MISO | 3V3 | AIN | AIN | AIN | AIN | AIN | AIN | SCK | MOSI | SCL | SDA | 0 | 1 | 2 | 3 | 4 | 5 | 6 | 7 | 8 | 9 | 10 | 11 | 12 | 13 | 14 | 15 | 16 | 19 | 20
tNames: 3V | D13 | MICRO:BIT GOES HERE LEDS FACING UP | GND | A0 | GND | D12 | 3V | NOPE | 3V TO M:B | GND | A1 | D11 | GND | 3V | GND | D10 | A2 | GND | GND | 3V | D9 | A3 | GND | GND | 3V | D6 | GND | A4 | GND | FEATHER TWO | 3V | 3V | D5 | A5 | GND | GND | FEATHER ONE | https://lynxruf.us/corounum